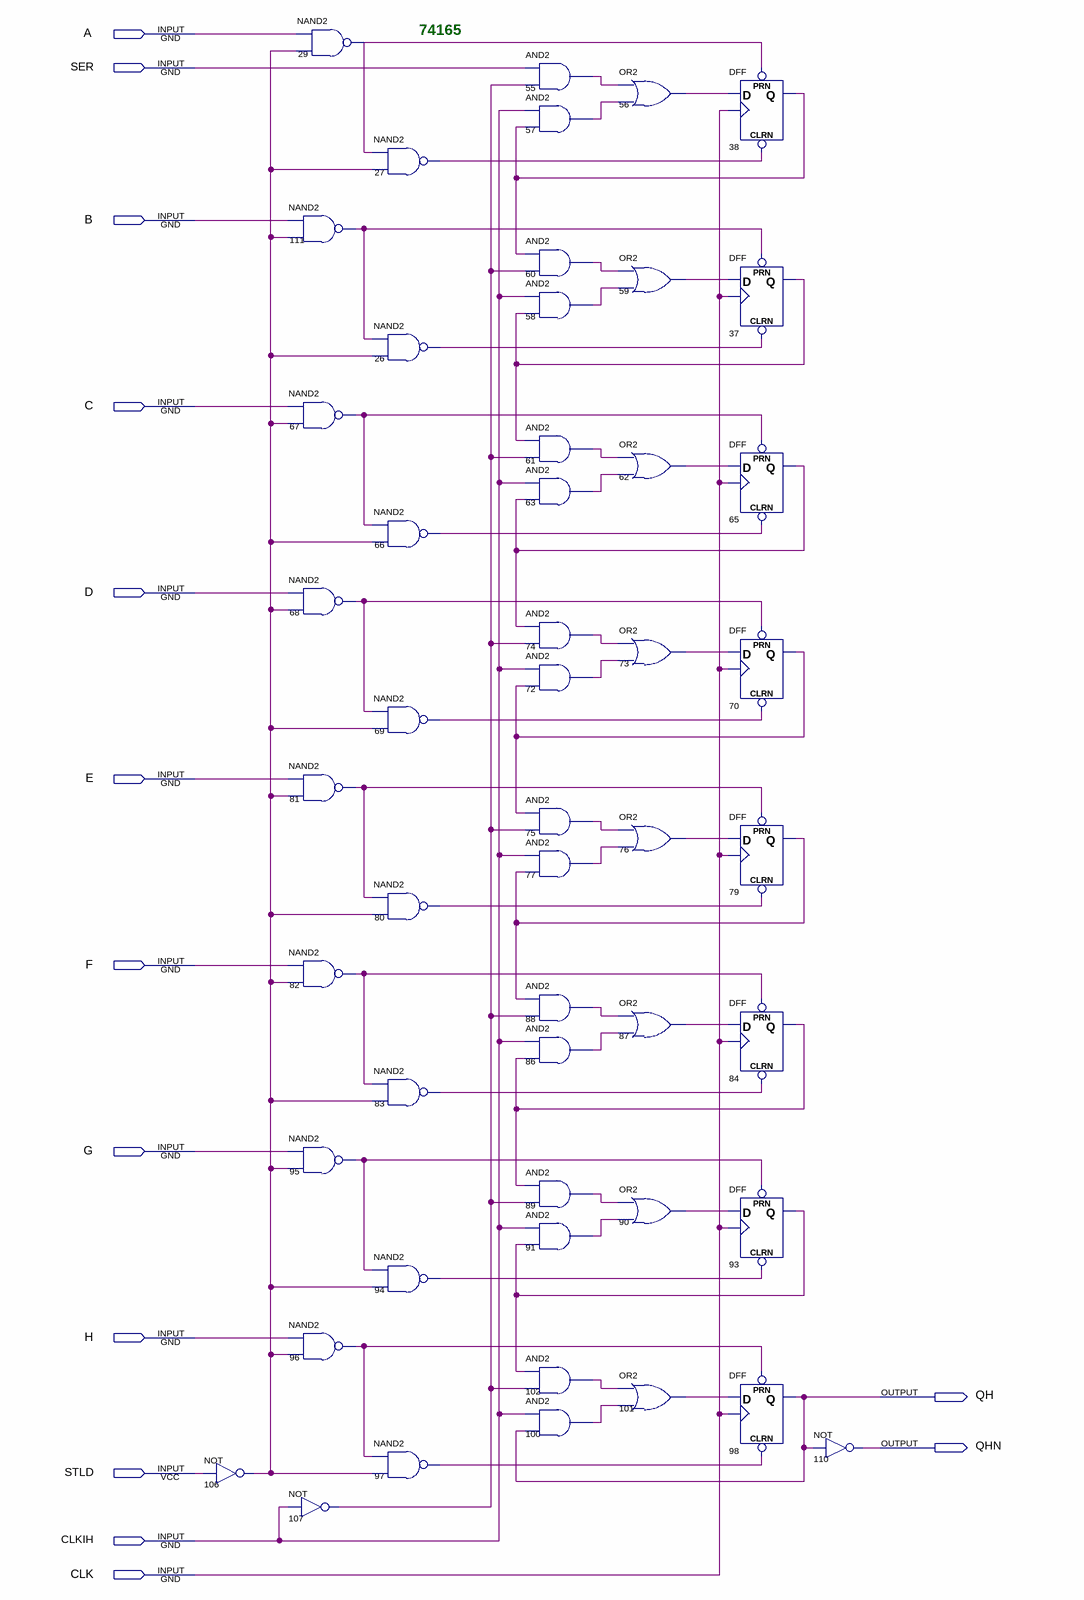
[diagram p0: schematic sheet]
// Quartus schematic 74165.bdf as structural Verilog: 51 symbols, 14 pins
module \74165  (
  input  A,
  input  SER,
  input  B,
  input  C,
  input  D,
  input  E,
  input  F,
  input  G,
  input  H,
  input  STLD,
  input  CLKIH,
  input  CLK,
  output QH,
  output QHN
);

  wire n26_out, n27_out, n29_out, n37_q, n38_q, n55_out, n56_out, n57_out, n58_out, n59_out, n60_out,
       n61_out, n62_out, n63_out, n65_q, n66_out, n67_out, n68_out, n69_out, n70_q, n72_out, n73_out,
       n74_out, n75_out, n76_out, n77_out, n79_q, n80_out, n81_out, n82_out, n83_out, n84_q, n86_out,
       n87_out, n88_out, n89_out, n90_out, n91_out, n93_q, n94_out, n95_out, n96_out, n97_out, n100_out,
       n101_out, n102_out, n106_out, n107_out, n111_out;

  not u_106 (n106_out, STLD);
  nand u_29 (n29_out, A, n106_out);
  nand u_111 (n111_out, B, n106_out);
  nand u_67 (n67_out, C, n106_out);
  nand u_68 (n68_out, D, n106_out);
  nand u_81 (n81_out, E, n106_out);
  nand u_82 (n82_out, F, n106_out);
  nand u_95 (n95_out, G, n106_out);
  nand u_96 (n96_out, H, n106_out);
  not u_107 (n107_out, CLKIH);
  nand u_27 (n27_out, n29_out, n106_out);
  nand u_26 (n26_out, n111_out, n106_out);
  nand u_66 (n66_out, n67_out, n106_out);
  nand u_69 (n69_out, n68_out, n106_out);
  nand u_80 (n80_out, n81_out, n106_out);
  nand u_83 (n83_out, n82_out, n106_out);
  nand u_94 (n94_out, n95_out, n106_out);
  nand u_97 (n97_out, n96_out, n106_out);
  and u_55 (n55_out, SER, n107_out);
  and u_57 (n57_out, CLKIH, n38_q);
  and u_60 (n60_out, n38_q, n107_out);
  and u_58 (n58_out, CLKIH, n37_q);
  and u_61 (n61_out, n37_q, n107_out);
  and u_63 (n63_out, CLKIH, n65_q);
  and u_74 (n74_out, n65_q, n107_out);
  and u_72 (n72_out, CLKIH, n70_q);
  and u_75 (n75_out, n70_q, n107_out);
  and u_77 (n77_out, CLKIH, n79_q);
  and u_88 (n88_out, n79_q, n107_out);
  and u_86 (n86_out, CLKIH, n84_q);
  and u_89 (n89_out, n84_q, n107_out);
  and u_91 (n91_out, CLKIH, n93_q);
  and u_102 (n102_out, n93_q, n107_out);
  and u_100 (n100_out, CLKIH, QH);
  or u_56 (n56_out, n55_out, n57_out);
  or u_59 (n59_out, n60_out, n58_out);
  or u_62 (n62_out, n61_out, n63_out);
  or u_73 (n73_out, n74_out, n72_out);
  or u_76 (n76_out, n75_out, n77_out);
  or u_87 (n87_out, n88_out, n86_out);
  or u_90 (n90_out, n89_out, n91_out);
  or u_101 (n101_out, n102_out, n100_out);
  DFF u_38 (.CLRN(n27_out), .CLK(CLK), .D(n56_out), .PRN(n29_out), .Q(n38_q));
  DFF u_37 (.CLRN(n26_out), .CLK(CLK), .D(n59_out), .PRN(n111_out), .Q(n37_q));
  DFF u_65 (.CLRN(n66_out), .CLK(CLK), .D(n62_out), .PRN(n67_out), .Q(n65_q));
  DFF u_70 (.CLRN(n69_out), .CLK(CLK), .D(n73_out), .PRN(n68_out), .Q(n70_q));
  DFF u_79 (.CLRN(n80_out), .CLK(CLK), .D(n76_out), .PRN(n81_out), .Q(n79_q));
  DFF u_84 (.CLRN(n83_out), .CLK(CLK), .D(n87_out), .PRN(n82_out), .Q(n84_q));
  DFF u_93 (.CLRN(n94_out), .CLK(CLK), .D(n90_out), .PRN(n95_out), .Q(n93_q));
  DFF u_98 (.CLRN(n97_out), .CLK(CLK), .D(n101_out), .PRN(n96_out), .Q(QH));
  not u_110 (QHN, QH);

  // Notes on the sheet:
  //   74165
endmodule
